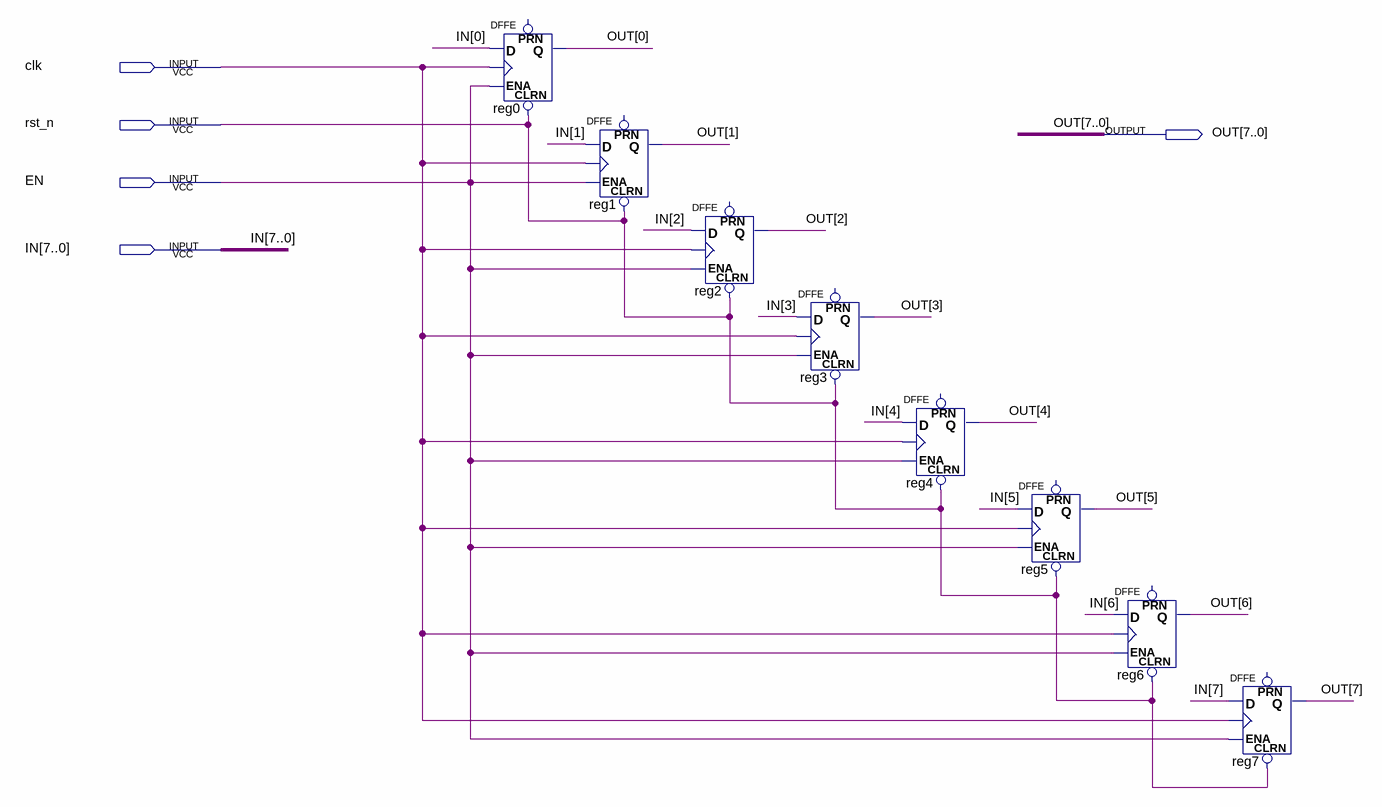
[diagram p0: schematic sheet]
// Quartus schematic Register_8_Bit.bdf as structural Verilog: 8 symbols, 5 pins
module Register_8_Bit (
  input  clk,
  input  rst_n,
  input  EN,
  input  [7:0] IN,
  output [7:0] OUT
);

  DFFE reg0 (.CLRN(rst_n), .D(IN[0]), .CLK(clk), .ENA(EN), .Q(OUT[0]));  // open: PRN
  DFFE reg1 (.CLRN(rst_n), .D(IN[1]), .CLK(clk), .ENA(EN), .Q(OUT[1]));  // open: PRN
  DFFE reg2 (.CLRN(rst_n), .D(IN[2]), .CLK(clk), .ENA(EN), .Q(OUT[2]));  // open: PRN
  DFFE reg3 (.CLRN(rst_n), .D(IN[3]), .CLK(clk), .ENA(EN), .Q(OUT[3]));  // open: PRN
  DFFE reg4 (.CLRN(rst_n), .D(IN[4]), .CLK(clk), .ENA(EN), .Q(OUT[4]));  // open: PRN
  DFFE reg5 (.CLRN(rst_n), .D(IN[5]), .CLK(clk), .ENA(EN), .Q(OUT[5]));  // open: PRN
  DFFE reg6 (.CLRN(rst_n), .D(IN[6]), .CLK(clk), .ENA(EN), .Q(OUT[6]));  // open: PRN
  DFFE reg7 (.CLRN(rst_n), .D(IN[7]), .CLK(clk), .ENA(EN), .Q(OUT[7]));  // open: PRN
endmodule
